# Altium schematic sheet RP2350.SchDoc
size B; SheetNumber: 3; SheetTotal: 9
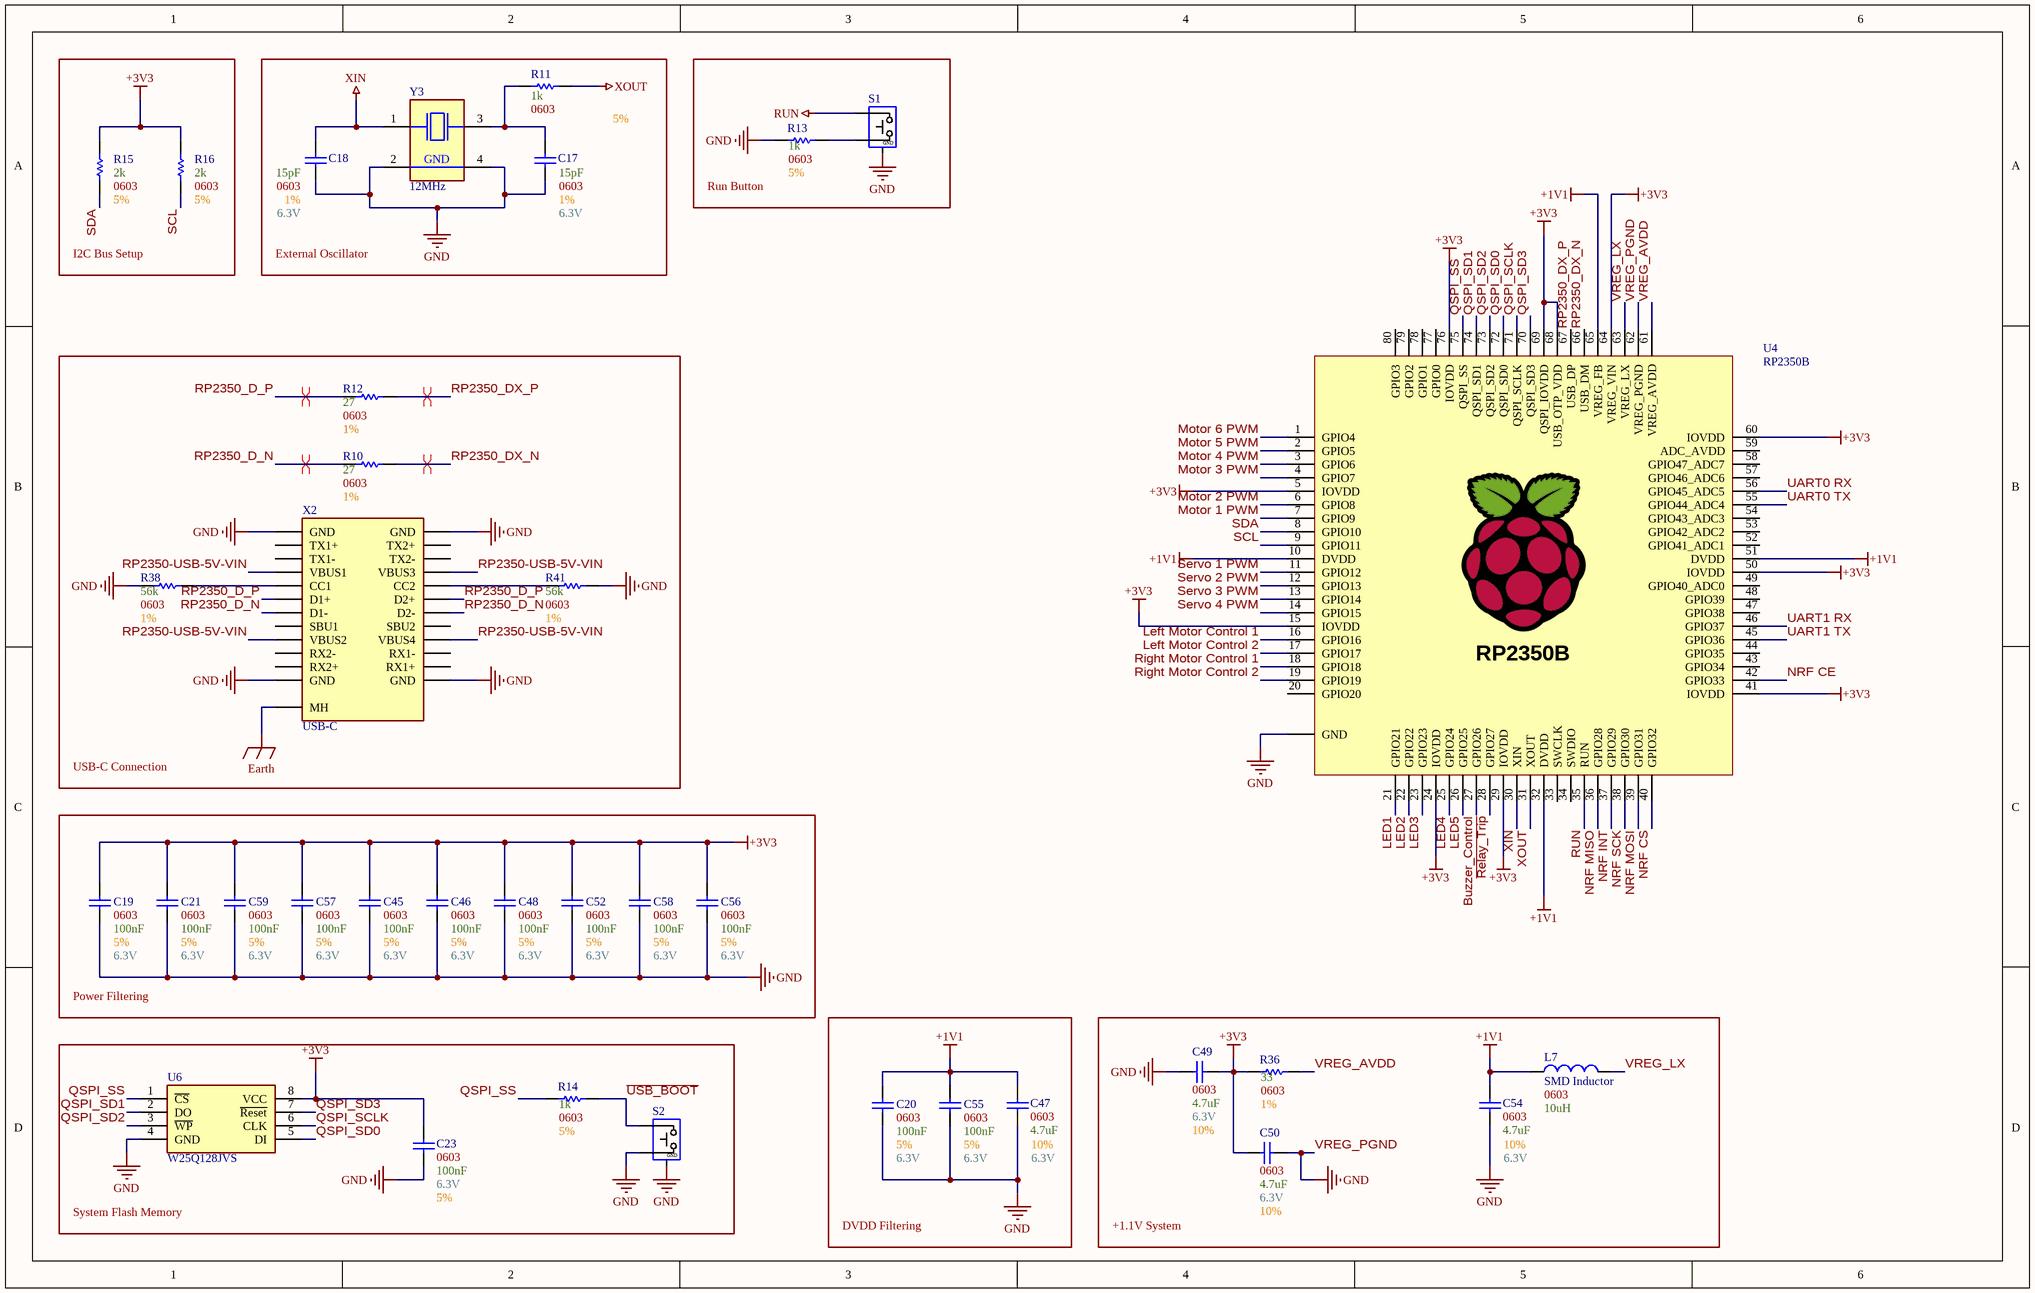
[diagram p0: RP2350.SchDoc]

## Parts
C17  Size Package: 0603  Capacitance: 15pF  Voltage: 6.3V  Tolerance: 1%  [[Cap] SMD 0603]  (hidden comment: [Cap] SMD Nonpolarized)
C18  Size Package: 0603  Capacitance: 15pF  Voltage: 6.3V  Tolerance: 1%  [[Cap] SMD 0603]  (hidden comment: [Cap] SMD Nonpolarized)
C19  Size Package: 0603  Capacitance: 100nF  Voltage: 6.3V  Tolerance: 5%  [[Cap] SMD 0603]  (hidden comment: [Cap] SMD Nonpolarized)
C20  Size Package: 0603  Capacitance: 100nF  Voltage: 6.3V  Tolerance: 5%  [[Cap] SMD 0603]  (hidden comment: [Cap] SMD Nonpolarized)
C21  Size Package: 0603  Capacitance: 100nF  Voltage: 6.3V  Tolerance: 5%  [[Cap] SMD 0603]  (hidden comment: [Cap] SMD Nonpolarized)
C23  Size Package: 0603  Capacitance: 100nF  Voltage: 6.3V  Tolerance: 5%  [[Cap] SMD 0603]  (hidden comment: [Cap] SMD Nonpolarized)
C45  Size Package: 0603  Capacitance: 100nF  Voltage: 6.3V  Tolerance: 5%  [[Cap] SMD 0603]  (hidden comment: [Cap] SMD Nonpolarized)
C46  Size Package: 0603  Capacitance: 100nF  Voltage: 6.3V  Tolerance: 5%  [[Cap] SMD 0603]  (hidden comment: [Cap] SMD Nonpolarized)
C47  Size Package: 0603  Capacitance: 4.7uF  Voltage: 6.3V  Tolerance: 10%  [[Cap] SMD 0603]  (hidden comment: [Cap] SMD Nonpolarized)
C48  Size Package: 0603  Capacitance: 100nF  Voltage: 6.3V  Tolerance: 5%  [[Cap] SMD 0603]  (hidden comment: [Cap] SMD Nonpolarized)
C49  Size Package: 0603  Capacitance: 4.7uF  Voltage: 6.3V  Tolerance: 10%  [[Cap] SMD 0603]  (hidden comment: [Cap] SMD Nonpolarized)
C50  Size Package: 0603  Capacitance: 4.7uF  Voltage: 6.3V  Tolerance: 10%  [[Cap] SMD 0603]  (hidden comment: [Cap] SMD Nonpolarized)
C52  Size Package: 0603  Capacitance: 100nF  Voltage: 6.3V  Tolerance: 5%  [[Cap] SMD 0603]  (hidden comment: [Cap] SMD Nonpolarized)
C54  Size Package: 0603  Capacitance: 4.7uF  Voltage: 6.3V  Tolerance: 10%  [[Cap] SMD 0603]  (hidden comment: [Cap] SMD Nonpolarized)
C55  Size Package: 0603  Capacitance: 100nF  Voltage: 6.3V  Tolerance: 5%  [[Cap] SMD 0603]  (hidden comment: [Cap] SMD Nonpolarized)
C56  Size Package: 0603  Capacitance: 100nF  Voltage: 6.3V  Tolerance: 5%  [[Cap] SMD 0603]  (hidden comment: [Cap] SMD Nonpolarized)
C57  Size Package: 0603  Capacitance: 100nF  Voltage: 6.3V  Tolerance: 5%  [[Cap] SMD 0603]  (hidden comment: [Cap] SMD Nonpolarized)
C58  Size Package: 0603  Capacitance: 100nF  Voltage: 6.3V  Tolerance: 5%  [[Cap] SMD 0603]  (hidden comment: [Cap] SMD Nonpolarized)
C59  Size Package: 0603  Capacitance: 100nF  Voltage: 6.3V  Tolerance: 5%  [[Cap] SMD 0603]  (hidden comment: [Cap] SMD Nonpolarized)
L7  SMD Inductor  Size Package: 0603  Inductance: 10uH  [[Inductor] SMD 0603]
R10  Tolerance: 1%  Resistance: 27  Size Package: 0603  [[Res] SMD 0603]  (hidden comment: [Res] SMD Resistor)
R11  Resistance: 1k  Size Package: 0603  Tolerance: 5%  [[Res] SMD 0603]  (hidden comment: [Res] SMD Resistor)
R12  Tolerance: 1%  Resistance: 27  Size Package: 0603  [[Res] SMD 0603]  (hidden comment: [Res] SMD Resistor)
R13  Resistance: 1k  Size Package: 0603  Tolerance: 5%  [[Res] SMD 0603]  (hidden comment: [Res] SMD Resistor)
R14  Resistance: 1k  Size Package: 0603  Tolerance: 5%  [[Res] SMD 0603]  (hidden comment: [Res] SMD Resistor)
R15  Resistance: 2k  Size Package: 0603  Tolerance: 5%  [[Res] SMD 0603]  (hidden comment: [Res] SMD Resistor)
R16  Resistance: 2k  Size Package: 0603  Tolerance: 5%  [[Res] SMD 0603]  (hidden comment: [Res] SMD Resistor)
R36  Resistance: 33  Size Package: 0603  Tolerance: 1%  [[Res] SMD 0603]  (hidden comment: [Res] SMD Resistor)
R38  Tolerance: 1%  Resistance: 56k  Size Package: 0603  [[Res] SMD 0603]  (hidden comment: [Res] SMD Resistor)
R41  Tolerance: 1%  Resistance: 56k  Size Package: 0603  [[Res] SMD 0603]  (hidden comment: [Res] SMD Resistor)
S1  [Switch] Pushbutton SMD  [[Switch] Pushbutton SMD 2]  (value not drawn)
S2  [Switch] Pushbutton SMD  [[Switch] Pushbutton SMD 2]  (value not drawn)
U4  RP2350B  [[MCU] RP2350B]
U6  W25Q128JVS  [[Mem] 16Mb Flash Memory]
X2  USB-C  [[Port] USB-C]
Y3  12MHz  [[XTAL] SMD 12MHz]

## Blocks framed on the sheet
I2C Bus Setup: R15 R16
External Oscillator: C17 C18 R11 Y3
Run Button: R13 S1
USB-C Connection: R10 R12 R38 R41 X2
Power Filtering: C19 C21 C45 C46 C48 C52 C56-C59
DVDD Filtering: C20 C47 C55
+1.1V System: C49 C50 C54 L7 R36
System Flash Memory: C23 R14 S2 U6

## Nets
+1V1: C20.2 C47.2 C54.2 C55.2 L7.1 U4.10(DVDD) U4.32(DVDD) U4.51(DVDD) U4.65(VREG_FB)
+3V3: C19.2 C21.2 C23.1 C45.2 C46.2 C48.2 C49.1 C50.2 C52.2 C56.2 C57.2 C58.2 C59.2 R15.2 R16.2 R36.2 U4.5(IOVDD) U4.15(IOVDD) U4.24(IOVDD) U4.29(IOVDD) U4.41(IOVDD) U4.50(IOVDD) U4.60(IOVDD) U4.64(VREG_VIN) U4.68(USB_OTP_VDD) U4.69(QSPI_IOVDD) U4.76(IOVDD) U6.8(VCC)
Earth: X2.MH
RUN: S1.1 U4.35(RUN)
VREG_PGND: C17.1 C18.1 C19.1 C20.1 C21.1 C23.2 C45.1 C46.1 C47.1 C48.1 C49.2 C50.1 C52.1 C54.1 C55.1 C56.1 C57.1 C58.1 C59.1 R13.2 R38.1 R41.2 S1.GND S2.2 S2.GND U4.62(VREG_PGND) U4.Pad(GND) U6.4(GND) X2.A1(GND) X2.A12(GND) X2.B1(GND) X2.B12(GND) Y3.2(GND) Y3.4(GND)  [also labelled GND]
XIN: C18.2 U4.30(XIN) Y3.1(XTAL1)
XOUT: R11.1 U4.31(XOUT)
~{Relay_Trip}: U4.28(GPIO27)
Buzzer_Control: U4.27(GPIO26)
LED1: U4.21(GPIO21)
LED2: U4.22(GPIO22)
LED3: U4.23(GPIO23)
LED4: U4.25(GPIO24)
LED5: U4.26(GPIO25)
Left Motor Control 1: U4.16(GPIO16)
Left Motor Control 2: U4.17(GPIO17)
Motor 1 PWM: U4.7(GPIO9)
Motor 2 PWM: U4.6(GPIO8)
Motor 3 PWM: U4.4(GPIO7)
Motor 4 PWM: U4.3(GPIO6)
Motor 5 PWM: U4.2(GPIO5)
Motor 6 PWM: U4.1(GPIO4)
NRF CE: U4.42(GPIO33)
NRF CS: U4.40(GPIO32)
NRF INT: U4.37(GPIO29)
NRF MISO: U4.36(GPIO28)
NRF MOSI: U4.39(GPIO31)
NRF SCK: U4.38(GPIO30)
QSPI_SCLK: U4.71(QSPI_SCLK) U6.6(CLK)
QSPI_SD0: U4.72(QSPI_SD0) U6.5(DI)
QSPI_SD1: U4.74(QSPI_SD1) U6.2(DO)
QSPI_SD2: U4.73(QSPI_SD2) U6.3(~{WP})
QSPI_SD3: U4.70(QSPI_SD3) U6.7(~{Reset})
QSPI_SS: R14.2 U4.75(QSPI_SS) U6.1(~{CS})
Right Motor Control 1: U4.18(GPIO18)
Right Motor Control 2: U4.19(GPIO19)
RP2350-USB-5V-VIN: X2.A4(VBUS1) X2.A9(VBUS2) X2.B4(VBUS3) X2.B9(VBUS4)
RP2350_D_N: R10.1 X2.A7(D1-) X2.B7(D2-)
RP2350_D_P: R12.1 X2.A6(D1+) X2.B6(D2+)
RP2350_DX_N: R10.2 U4.66(USB_DM)
RP2350_DX_P: R12.2 U4.67(USB_DP)
SCL: R16.1 U4.9(GPIO11)
SDA: R15.1 U4.8(GPIO10)
Servo 1 PWM: U4.11(GPIO12)
Servo 2 PWM: U4.12(GPIO13)
Servo 3 PWM: U4.13(GPIO14)
Servo 4 PWM: U4.14(GPIO15)
~{USB_BOOT}: R14.1 S2.1
UART0 RX: U4.56(GPIO45_ADC5)
UART0 TX: U4.55(GPIO44_ADC4)
UART1 RX: U4.46(GPIO37)
UART1 TX: U4.45(GPIO36)
VREG_AVDD: R36.1 U4.61(VREG_AVDD)
VREG_LX: L7.2 U4.63(VREG_LX)
NetC17_2: C17.2 R11.2 Y3.3(XTAL2)
NetR13_1: R13.1 S1.2
NetR38_2: R38.2 X2.A5(CC1)
NetR41_1: R41.1 X2.B5(CC2)

Not connected (* = marked no-connect by the designer): U4 20(GPIO20) 33(SWCLK) 34(SWDIO) 43(GPIO34) 44(GPIO35) 47(GPIO38) 48(GPIO39) 49(GPIO40_ADC0) 52(GPIO41_ADC1) 53(GPIO42_ADC2) 54(GPIO43_ADC3) 57(GPIO46_ADC6) 58(GPIO47_ADC7) 59(ADC_AVDD) 77(GPIO0) 78(GPIO1) 79(GPIO2) 80(GPIO3); X2 A2(TX1+) A3(TX1-) A8(SBU1) A10(RX2-) A11(RX2+) B2(TX2+) B3(TX2-) B8(SBU2) B10(RX1-) B11(RX1+)

## Layout directives
differential pair; differential pair class USB_Pairs: RP2350_D_N, RP2350_D_P, RP2350_DX_N, RP2350_DX_P

## Library data of the parts
L7 = [Inductor] SMD Inductor: JLC Part #: *; Mouser Part #: *; Supplier 1: DigiKey; Supplier Part Number 1: 445-6755-1-ND
R10-R16 R36 R38 R41 = [Res] SMD Resistor: Generic; Supplier 1: DigiKey
  R10 R12: Supplier Part Number 1: 749-1631-1-ND
  R11 R13 R14: Supplier Part Number 1: RMCF0603FT1K00DKR-ND
  R15 R16: Supplier Part Number 1: P2.0KBDCT-ND
  R36: Supplier Part Number 1: RR08Q33DCT-ND
  R38 R41: Supplier Part Number 1: A129709CT-ND
U4 = [MCU] RP2350B: QFN-80 Package; Supplier 1: DigiKey; Supplier Part Number 1: 2648-SC1510-A4CT-ND
U6 = [Mem] 16Mb Flash Memory: W25Q128JVSIQ TR; Supplier 1: DigiKey; Supplier Part Number 1: 256-W25Q128JVSIQTRCT-ND
X2 = [Port] USB Type-C: Supplier 1: DigiKey; Supplier Part Number 1: 670-3104-1-ND
Y3 = [XTAL] SMD 12MHz: 815-ABM8-272-T3; Supplier 1: DigiKey; Supplier Part Number 1: 535-ABM8-272-T3CT-ND
C17-C21 C23 C45-C50 C52 C54-C59 = [Cap] SMD Nonpolarized: Supplier 1: DigiKey
  C17 C18: Supplier Part Number 1: 490-16416-1-ND
  C19-C21 C23 C45 C46 C48 C52 C55-C59: Supplier Part Number 1: 311-1088-6-ND
  C47 C49 C50 C54: Supplier Part Number 1: 490-7203-1-ND
S1 S2 = [Switch] Pushbutton SMD: Supplier 1: DigiKey; Supplier Part Number 1: SW1021CT-ND